# Altium schematic sheet MCU2S copy.SchDoc
size B; SheetNumber: 1; SheetTotal: 1
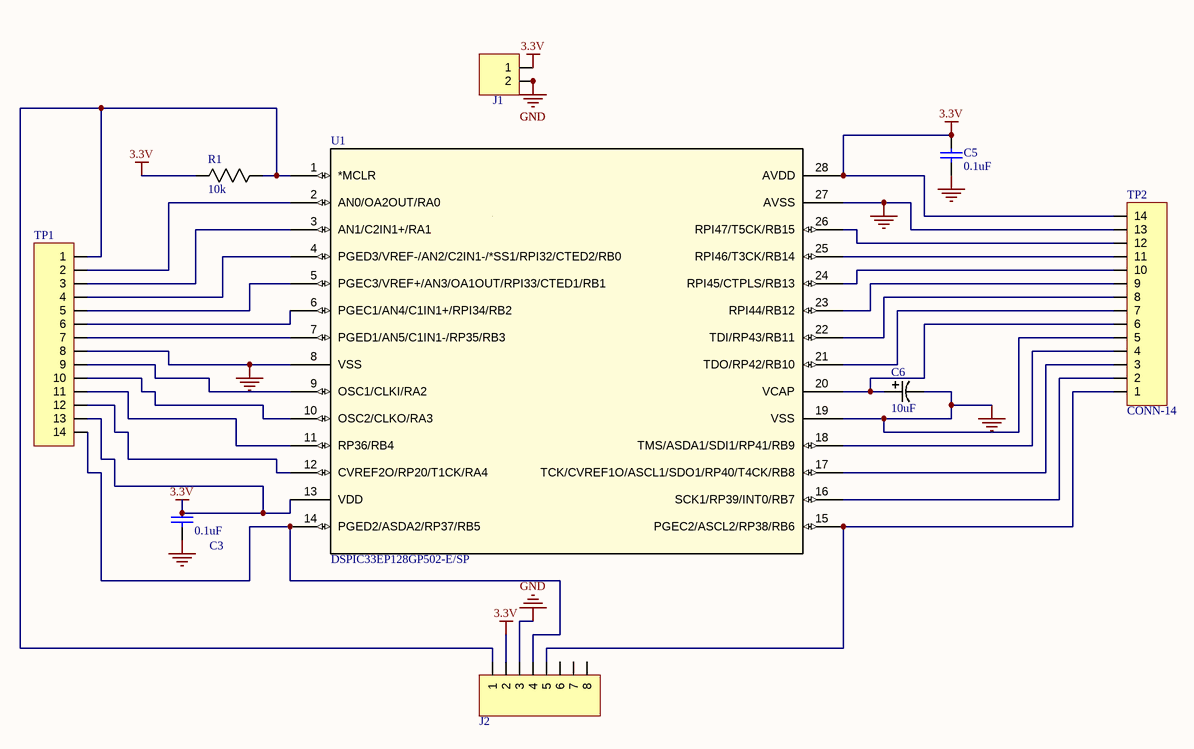
[diagram p0: MCU2S copy.SchDoc]

## Parts
C3  value 0.1uF  [0603]  (hidden comment: C1206C104KARACTU)
C5  value 0.1uF  [0603]  (hidden comment: C1206C104KARACTU)
C6  value 10uF  [TAJA106M010RNJ]  (hidden comment: TAJA106M010RNJ)
J1  CONN-2  [CONN-2]  (value not drawn)
J2  CONN-8  [CONN-8]  (value not drawn)
R1  value 10k  [0805]  (hidden comment: RES 10K OHM 1% 1/8W 0805)
TP1  (no value)  [CONN-14]
TP2  CONN-14  [CONN-14]
U1  DSPIC33EP128GP502-E/SP  [DSPIC33EP128GP502]

## Nets
3.3V: C3.2 C5.2 J1.1 J2.2 R1.1 TP1.13 TP2.14 U1.13(VDD) U1.28(AVDD)
GND: C3.1 C5.1 C6.2 J1.2 J2.3 TP1.8 TP2.5 TP2.13 U1.8(VSS) U1.19(VSS) U1.27(AVSS)
NetC6_1: C6.1 TP2.6 U1.20(VCAP)
NetJ2_1: J2.1 R1.2 TP1.1 U1.1(*MCLR)
NetJ2_4: J2.4 TP1.14 U1.14(PGED2/ASDA2/RP37/RB5)
NetJ2_5: J2.5 TP2.1 U1.15(PGEC2/ASCL2/RP38/RB6)
NetTP1_2: TP1.2 U1.2(AN0/OA2OUT/RA0)
NetTP1_3: TP1.3 U1.3(AN1/C2IN1+/RA1)
NetTP1_4: TP1.4 U1.4(PGED3/VREF-/AN2/C2IN1-/*SS1/RPI32/CTED2/RB0)
NetTP1_5: TP1.5 U1.5(PGEC3/VREF+/AN3/OA1OUT/RPI33/CTED1/RB1)
NetTP1_6: TP1.6 U1.6(PGEC1/AN4/C1IN1+/RPI34/RB2)
NetTP1_7: TP1.7 U1.7(PGED1/AN5/C1IN1-/RP35/RB3)
NetTP1_9: TP1.9 U1.9(OSC1/CLKI/RA2)
NetTP1_10: TP1.10 U1.10(OSC2/CLKO/RA3)
NetTP1_11: TP1.11 U1.11(RP36/RB4)
NetTP1_12: TP1.12 U1.12(CVREF2O/RP20/T1CK/RA4)
NetTP2_2: TP2.2 U1.16(SCK1/RP39/INT0/RB7)
NetTP2_3: TP2.3 U1.17(TCK/CVREF1O/ASCL1/SDO1/RP40/T4CK/RB8)
NetTP2_4: TP2.4 U1.18(TMS/ASDA1/SDI1/RP41/RB9)
NetTP2_7: TP2.7 U1.21(TDO/RP42/RB10)
NetTP2_8: TP2.8 U1.22(TDI/RP43/RB11)
NetTP2_9: TP2.9 U1.23(RPI44/RB12)
NetTP2_10: TP2.10 U1.24(RPI45/CTPLS/RB13)
NetTP2_11: TP2.11 U1.25(RPI46/T3CK/RB14)
NetTP2_12: TP2.12 U1.26(RPI47/T5CK/RB15)

Not connected (* = marked no-connect by the designer): J2 6 7 8

## Notes on the sheet
- Title:
- Company Name:
- Date:
- File:

## Library data of the parts
C3 C5 = C1206C104KARACTU: CAP CER 0.1UF 250V X7R 1206
C6 = TAJA106M010RNJ: CAP TANT 10UF 20% 10V 1206
J2 = CONN-8: J?
R1 = RMCF0805FT10K0: 10 kOhms ±1% 0.125W, 1/8W Chip Resistor 0805 (2012 Metric) Automotive AEC-Q200 Thick Film
TP1 = CONN-14
U1 = DSPIC33EP128GP502-E/SP: IC MCU 16BIT 128KB FLASH 28SPDIP